# EAGLE schematic Weapons panel - bottom (EAGLE 6.5.0)
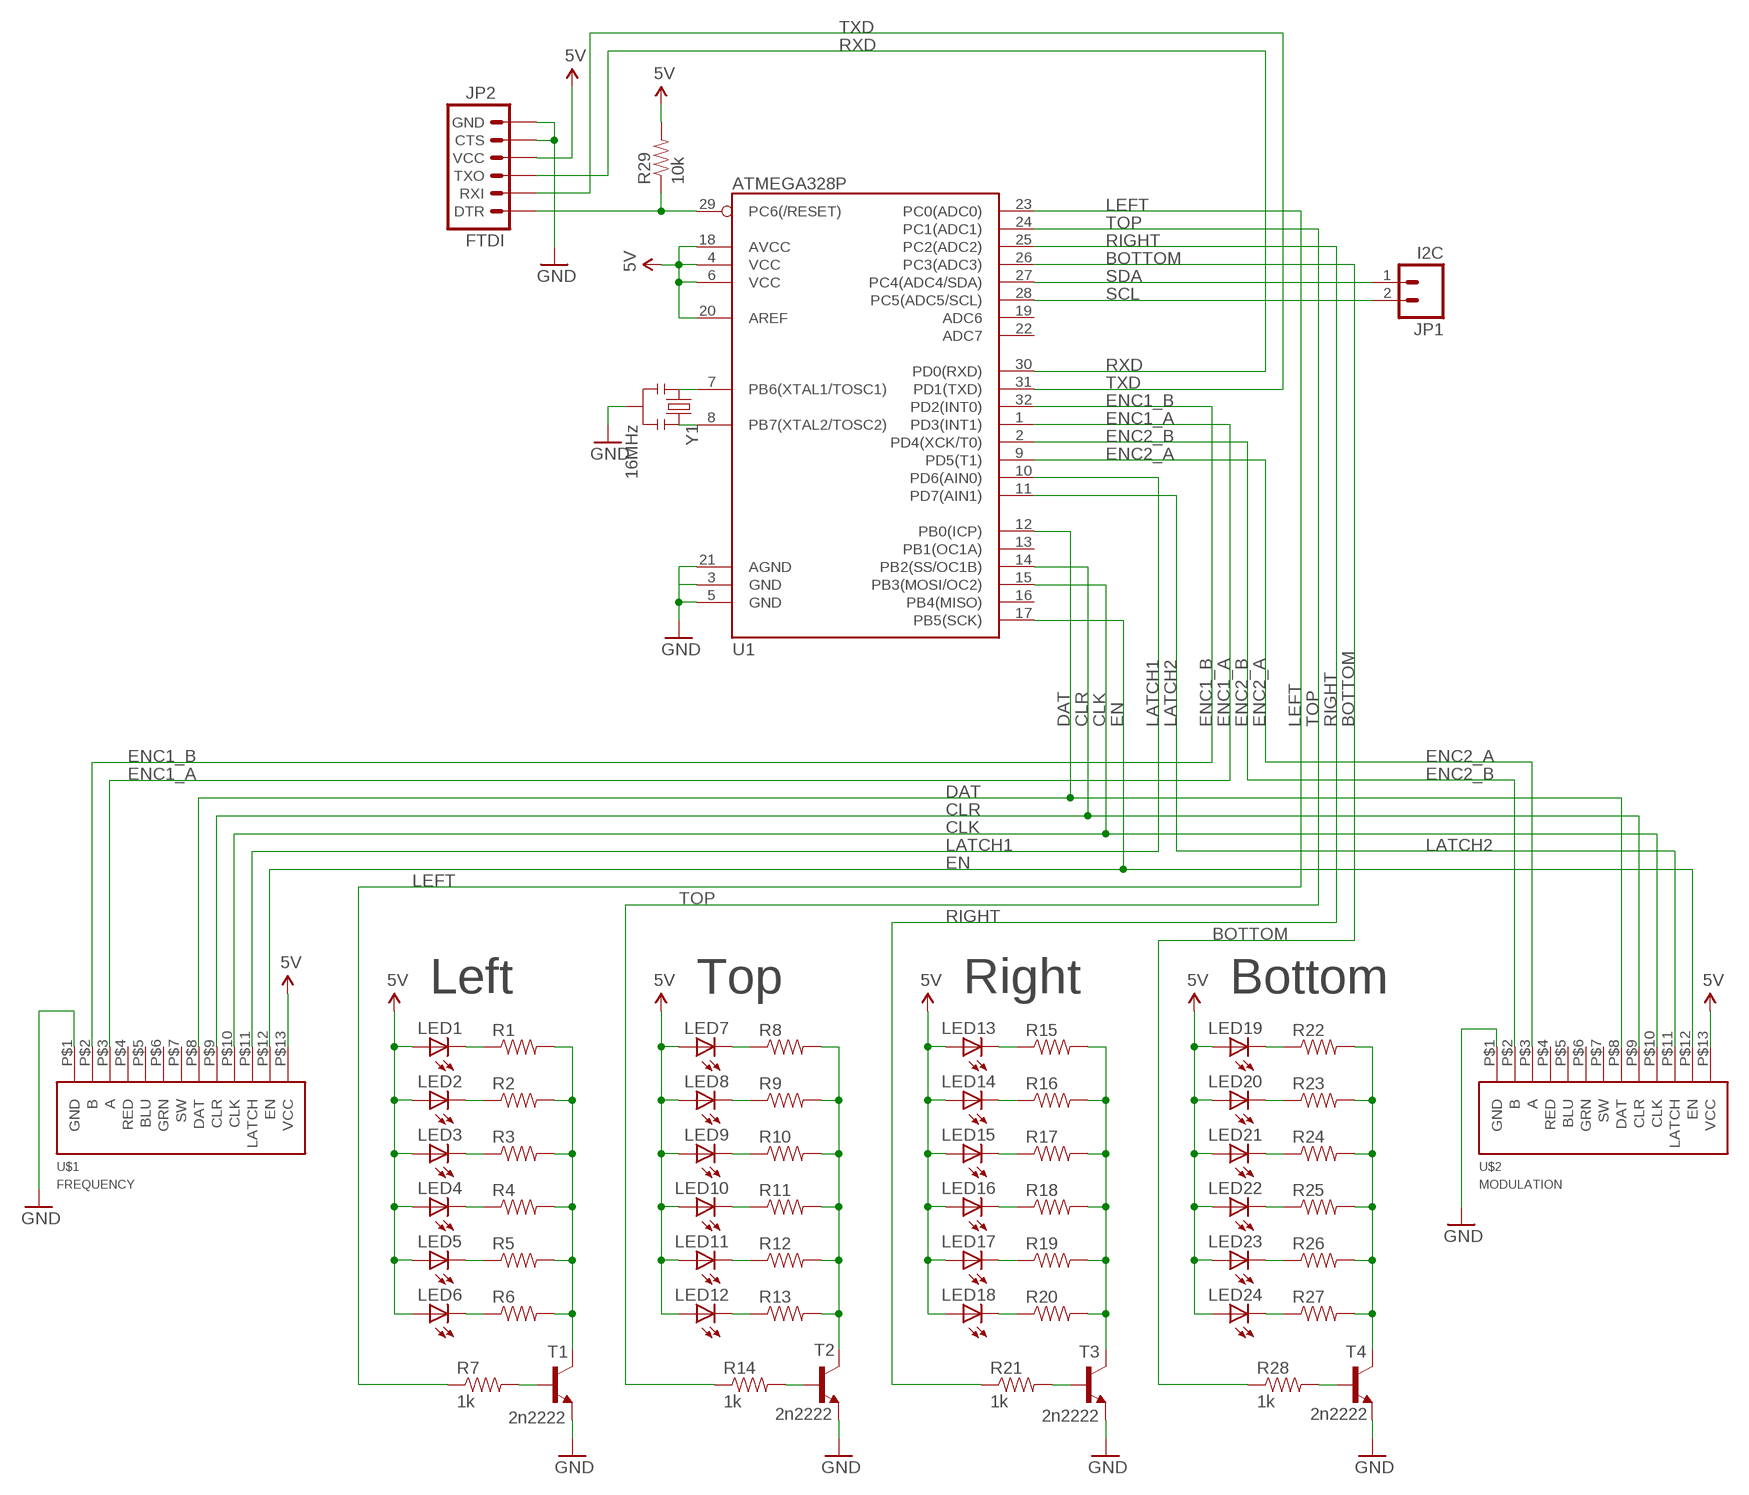
[diagram p0: schematic, sheet 1]

## Parts
JP1  I2C  M02PTH  [1X02]
JP2  FTDI  ARDUINO_SERIAL_PROGRAMPTH  [1X06]
LED1  LED5MM  [LED5MM]
LED2  LED5MM  [LED5MM]
LED3  LED5MM  [LED5MM]
LED4  LED5MM  [LED5MM]
LED5  LED5MM  [LED5MM]
LED6  LED5MM  [LED5MM]
LED7  LED5MM  [LED5MM]
LED8  LED5MM  [LED5MM]
LED9  LED5MM  [LED5MM]
LED10  LED5MM  [LED5MM]
LED11  LED5MM  [LED5MM]
LED12  LED5MM  [LED5MM]
LED13  LED5MM  [LED5MM]
LED14  LED5MM  [LED5MM]
LED15  LED5MM  [LED5MM]
LED16  LED5MM  [LED5MM]
LED17  LED5MM  [LED5MM]
LED18  LED5MM  [LED5MM]
LED19  LED5MM  [LED5MM]
LED20  LED5MM  [LED5MM]
LED21  LED5MM  [LED5MM]
LED22  LED5MM  [LED5MM]
LED23  LED5MM  [LED5MM]
LED24  LED5MM  [LED5MM]
R1  RESISTORKIT  [AXIAL-0.3-KIT]
R2  RESISTORKIT  [AXIAL-0.3-KIT]
R3  RESISTORKIT  [AXIAL-0.3-KIT]
R4  RESISTORKIT  [AXIAL-0.3-KIT]
R5  RESISTORKIT  [AXIAL-0.3-KIT]
R6  RESISTORKIT  [AXIAL-0.3-KIT]
R7  1k  RESISTORKIT  [AXIAL-0.3-KIT]
R8  RESISTORKIT  [AXIAL-0.3-KIT]
R9  RESISTORKIT  [AXIAL-0.3-KIT]
R10  RESISTORKIT  [AXIAL-0.3-KIT]
R11  RESISTORKIT  [AXIAL-0.3-KIT]
R12  RESISTORKIT  [AXIAL-0.3-KIT]
R13  RESISTORKIT  [AXIAL-0.3-KIT]
R14  1k  RESISTORKIT  [AXIAL-0.3-KIT]
R15  RESISTORKIT  [AXIAL-0.3-KIT]
R16  RESISTORKIT  [AXIAL-0.3-KIT]
R17  RESISTORKIT  [AXIAL-0.3-KIT]
R18  RESISTORKIT  [AXIAL-0.3-KIT]
R19  RESISTORKIT  [AXIAL-0.3-KIT]
R20  RESISTORKIT  [AXIAL-0.3-KIT]
R21  1k  RESISTORKIT  [AXIAL-0.3-KIT]
R22  RESISTORKIT  [AXIAL-0.3-KIT]
R23  RESISTORKIT  [AXIAL-0.3-KIT]
R24  RESISTORKIT  [AXIAL-0.3-KIT]
R25  RESISTORKIT  [AXIAL-0.3-KIT]
R26  RESISTORKIT  [AXIAL-0.3-KIT]
R27  RESISTORKIT  [AXIAL-0.3-KIT]
R28  1k  RESISTORKIT  [AXIAL-0.3-KIT]
R29  10k  RESISTORKIT  [AXIAL-0.3-KIT]
T1  2n2222  2N2222-NPN-TO92-EBC  [TO92-EBC]
T2  2n2222  2N2222-NPN-TO92-EBC  [TO92-EBC]
T3  2n2222  2N2222-NPN-TO92-EBC  [TO92-EBC]
T4  2n2222  2N2222-NPN-TO92-EBC  [TO92-EBC]
U1  ATMEGA328P  ATMEGA328_SMT  [TQFP32-08]
U$1  FREQUENCY  CIRCULAR_LED_BREAKOUT  [CIRCULAR_LED_BREAKOUT]
U$2  MODULATION  CIRCULAR_LED_BREAKOUT  [CIRCULAR_LED_BREAKOUT]
Y1  16MHz  RESONATOR16MHZ  [RESONATOR-SMD]

## Nets
5V: JP2.4(VCC) LED1.A LED2.A LED3.A LED4.A LED5.A LED6.A LED7.A LED8.A LED9.A LED10.A LED11.A LED12.A LED13.A LED14.A LED15.A LED16.A LED17.A LED18.A LED19.A LED20.A LED21.A LED22.A LED23.A LED24.A R29.P$2 U1.4(VCC) U1.6(VCC) U1.18(AVCC) U1.20(AREF) U$1.P$13(VCC) U$2.P$13(VCC)
BOTTOM: R28.P$1 U1.26(PC3(ADC3))
CLK: U1.15(PB3(MOSI/OC2)) U$1.P$10(CLK) U$2.P$10(CLK)
CLR: U1.14(PB2(SS/OC1B)) U$1.P$9(CLR) U$2.P$9(CLR)
DAT: U1.12(PB0(ICP)) U$1.P$8(DAT) U$2.P$8(DAT)
EN: U1.17(PB5(SCK)) U$1.P$12(EN) U$2.P$12(EN)
ENC1_A: U1.1(PD3(INT1)) U$1.P$3(A)
ENC1_B: U1.32(PD2(INT0)) U$1.P$2(B)
ENC2_A: U1.9(PD5(T1)) U$2.P$3(A)
ENC2_B: U1.2(PD4(XCK/T0)) U$2.P$2(B)
GND: JP2.5(CTS) JP2.6(GND) T1.E T2.E T3.E T4.E U1.3(GND) U1.5(GND) U1.21(AGND) U$1.P$1(GND) U$2.P$1(GND) Y1.2
LATCH1: U1.10(PD6(AIN0)) U$1.P$11(LATCH)
LATCH2: U1.11(PD7(AIN1)) U$2.P$11(LATCH)
LEFT: R7.P$1 U1.23(PC0(ADC0))
N$1: LED1.K(C) R1.P$1
N$2: LED2.K(C) R2.P$1
N$3: LED3.K(C) R3.P$1
N$4: LED4.K(C) R4.P$1
N$5: LED5.K(C) R5.P$1
N$6: LED6.K(C) R6.P$1
N$7: R1.P$2 R2.P$2 R3.P$2 R4.P$2 R5.P$2 R6.P$2 T1.C
N$8: R7.P$2 T1.B
N$9: LED7.K(C) R8.P$1
N$10: LED8.K(C) R9.P$1
N$11: LED9.K(C) R10.P$1
N$12: LED10.K(C) R11.P$1
N$13: LED11.K(C) R12.P$1
N$14: LED12.K(C) R13.P$1
N$15: R8.P$2 R9.P$2 R10.P$2 R11.P$2 R12.P$2 R13.P$2 T2.C
N$16: R14.P$2 T2.B
N$17: LED13.K(C) R15.P$1
N$18: LED14.K(C) R16.P$1
N$19: LED15.K(C) R17.P$1
N$20: LED16.K(C) R18.P$1
N$21: LED17.K(C) R19.P$1
N$22: LED18.K(C) R20.P$1
N$23: R15.P$2 R16.P$2 R17.P$2 R18.P$2 R19.P$2 R20.P$2 T3.C
N$24: R21.P$2 T3.B
N$25: LED19.K(C) R22.P$1
N$26: LED20.K(C) R23.P$1
N$27: LED21.K(C) R24.P$1
N$28: LED22.K(C) R25.P$1
N$29: LED23.K(C) R26.P$1
N$30: LED24.K(C) R27.P$1
N$31: R22.P$2 R23.P$2 R24.P$2 R25.P$2 R26.P$2 R27.P$2 T4.C
N$32: R28.P$2 T4.B
N$38: JP2.1(DTR) R29.P$1 U1.29(PC6(/RESET))
N$39: U1.8(PB7(XTAL2/TOSC2)) Y1.3
N$40: U1.7(PB6(XTAL1/TOSC1)) Y1.1
RIGHT: R21.P$1 U1.25(PC2(ADC2))
RXD: JP2.3(TXO) U1.30(PD0(RXD))
SCL: JP1.2 U1.28(PC5(ADC5/SCL))
SDA: JP1.1 U1.27(PC4(ADC4/SDA))
TOP: R14.P$1 U1.24(PC1(ADC1))
TXD: JP2.2(RXI) U1.31(PD1(TXD))
Unconnected: U1.13(PB1(OC1A)) U1.16(PB4(MISO)) U1.19(ADC6) U1.22(ADC7) U$1.P$4(RED) U$1.P$5(BLU) U$1.P$6(GRN) U$1.P$7(SW) U$2.P$4(RED) U$2.P$5(BLU) U$2.P$6(GRN) U$2.P$7(SW)

## Notes on the sheet
- Left | Top | Right | Bottom

## Library data of the parts
JP1 = SparkFun-Connectors:M02: Standard 2-pin 0.1" header. Use with - straight break away headers ( PRT-00116) - right angle break away headers (PRT-00553) - swiss pins (PRT-00743) - machine pins (PRT-00117) - female headers (PRT-00115) Molex polarized connector foot print use with: PRT-08233 with associated crimp pins and housings. 2.54_SCREWTERM for use with PRT-10571. 3.5mm Screw Terminal footprints for PRT-08084 5mm Screw Terminal footprints for use with PRT-08433
JP2 = SparkFun-Connectors:ARDUINO_SERIAL_PROGRAM: FTDI connector footprints
LED1-LED24 = adafruit:LED: LED OSRAM: - CHIPLED LG R971, LG N971, LY N971, LG Q971, LY Q971, LO R971, LY R971 LH N974, LH R974 LS Q976, LO Q976, LY Q976 LO Q996 - Hyper CHIPLED LW Q18S LB Q993, LB Q99A, LB R99A - SideLED LS A670, LO A670, LY A670, LG A670, LP A670 LB A673, LV A673, LT A673, LW A673 LH A674 LY A675 LS A676, LA A676, LO A676, LY A676, LW A676 LS A679, LY A679, LG A679 - Hyper Micro SIDELED® LS Y876, LA Y876, LO Y876, LY Y876 LT Y87S - SmartLED LW L88C, LW L88S LB L89C, LB L89S, LG L890 LS L89K, LO L89K, LY L89K LS L896, LA L896, LO L896, LY L896 - TOPLED LS T670, LO T670, LY T670, LG T670, LP T670 LSG T670, LSP T670, LSY T670, LOP T670, LYG T670 LG T671, LOG T671, LSG T671 LB T673, LV T673, LT T673, LW T673 LH T674 LS T676, LA T676, LO T676, LY T676, LB T676, LH T676, LSB T676, LW T676 LB T67C, LV T67C, LT T67C, LS T67K, LO T67K, LY T67K, LW E67C LS E67B, LA E67B, LO E67B, LY E67B, LB E67C, LV E67C, LT E67C LW T67C LS T679, LY T679, LG T679 LS T770, LO T770, LY T770, LG T770, LP T770 LB T773, LV T773, LT T773, LW T773 LH T774 LS E675, LA E675, LY E675, LS T675 LS T776, LA T776, LO T776, LY T776, LB T776 LHGB T686 LT T68C, LB T68C - Hyper Mini TOPLED® LB M676 - Mini TOPLED Santana® LG M470 LS M47K, LO M47K, LY M47K Source: http://www.osram.convergy.de/
R1-R29 = SparkFun-Passives:RESISTOR: Resistor Basic schematic elements and footprints for 0603, 1206, and PTH resistors.
T1-T4 = transistor-neu-to92:*-NPN-: NPN Transistror
U1 = SparkFun-DigitalIC:ATMEGA328_SMT: 32-Pin Atmega328 part Commonly used on Arduino compatible boards Available in QFP and QFN packages TQFP is IC-09069 QFN is non-stock; PROD_ID: IC-09069
U$1 U$2 = circular_led_breakout:CIRCULAR_LED_BREAKOUT
Y1 = SparkFun-FreqCtrl:RESONATOR: Resonator Small SMD resonator. Used, eg, on the Arduino Pro/ Pro Mini boards. 8MHz- XTAL-08895 16MHz- XTAL-08900; PROD_ID: XTAL-08900